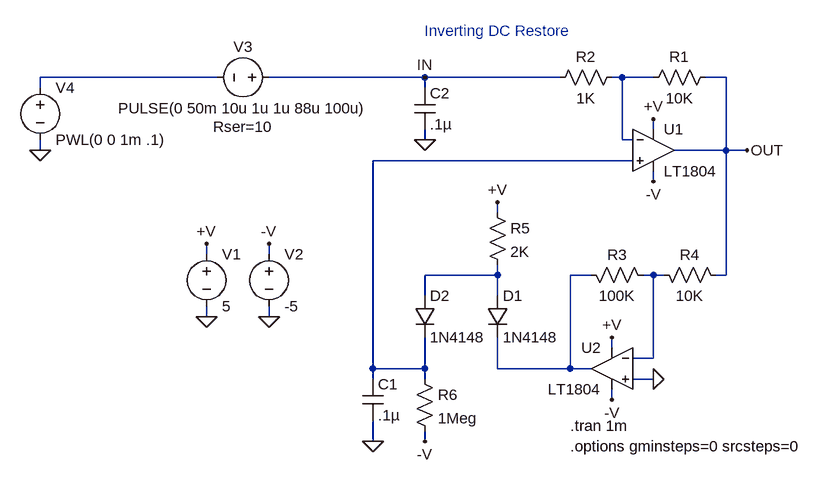
[diagram p0: schematic 1804.asc]
1804.asc, the LTspice schematic file:
Version 4
SHEET 1 896 740
WIRE -464 80 -736 80
WIRE -144 80 -384 80
WIRE 64 80 -144 80
WIRE 160 80 144 80
WIRE 208 80 160 80
WIRE 320 80 288 80
WIRE -736 96 -736 80
WIRE -144 96 -144 80
WIRE 208 160 208 144
WIRE -144 176 -144 160
WIRE 160 176 160 80
WIRE 176 176 160 176
WIRE -736 192 -736 176
WIRE 320 192 320 80
WIRE 320 192 240 192
WIRE 352 192 320 192
WIRE 176 208 -224 208
WIRE 208 240 208 224
WIRE -32 288 -32 272
WIRE -480 352 -480 336
WIRE -384 352 -384 336
WIRE -32 384 -32 368
WIRE -32 384 -144 384
WIRE 112 384 80 384
WIRE 208 384 192 384
WIRE 224 384 208 384
WIRE 320 384 320 192
WIRE 320 384 304 384
WIRE -144 416 -144 384
WIRE -32 416 -32 384
WIRE -480 448 -480 432
WIRE -384 448 -384 432
WIRE 144 496 144 480
WIRE 208 512 208 384
WIRE 208 512 176 512
WIRE -224 528 -224 208
WIRE -144 528 -144 480
WIRE -144 528 -224 528
WIRE -32 528 -32 480
WIRE 80 528 80 384
WIRE 80 528 -32 528
WIRE 112 528 80 528
WIRE -224 544 -224 528
WIRE -144 544 -144 528
WIRE 208 544 176 544
WIRE 144 576 144 560
WIRE -224 640 -224 608
WIRE -144 640 -144 624
FLAG -480 448 0
FLAG 208 144 +V
FLAG -480 336 +V
FLAG 208 240 -V
FLAG -384 448 0
FLAG -384 336 -V
FLAG 144 480 +V
FLAG 144 576 -V
FLAG 208 544 0
FLAG -32 272 +V
FLAG -224 640 0
FLAG -736 192 0
FLAG 352 192 OUT
FLAG -144 640 -V
FLAG -144 176 0
FLAG -144 80 IN
SYMBOL voltage -480 336 R0
SYMATTR InstName V1
SYMATTR Value 5
SYMBOL voltage -384 336 R0
SYMATTR InstName V2
SYMATTR Value -5
SYMBOL res 304 64 R90
WINDOW 0 0 56 VBottom 2
WINDOW 3 32 56 VTop 2
SYMATTR InstName R1
SYMATTR Value 10K
SYMBOL res 160 64 R90
WINDOW 0 0 56 VBottom 2
WINDOW 3 32 56 VTop 2
SYMATTR InstName R2
SYMATTR Value 1K
SYMBOL res 96 368 M90
WINDOW 0 0 56 VBottom 2
WINDOW 3 32 56 VTop 2
SYMATTR InstName R3
SYMATTR Value 100K
SYMBOL res 208 368 M90
WINDOW 0 0 56 VBottom 2
WINDOW 3 32 56 VTop 2
SYMATTR InstName R4
SYMATTR Value 10K
SYMBOL diode -48 416 R0
SYMATTR InstName D1
SYMATTR Value 1N4148
SYMBOL diode -160 416 R0
SYMATTR InstName D2
SYMATTR Value 1N4148
SYMBOL res -48 272 R0
SYMATTR InstName R5
SYMATTR Value 2K
SYMBOL res -160 528 R0
SYMATTR InstName R6
SYMATTR Value 1Meg
SYMBOL cap -240 544 R0
SYMATTR InstName C1
SYMATTR Value .1µ
SYMBOL voltage -368 80 R90
WINDOW 39 60 56 VTop 2
WINDOW 0 -32 56 VBottom 2
WINDOW 3 32 56 VTop 2
SYMATTR SpiceLine Rser=10
SYMATTR InstName V3
SYMATTR Value PULSE(0 50m 10u 1u 1u 88u 100u)
SYMBOL voltage -736 80 R0
WINDOW 123 0 0 Left 2
WINDOW 39 0 0 Left 2
SYMATTR InstName V4
SYMATTR Value PWL(0 0 1m .1)
SYMBOL cap -160 96 R0
SYMATTR InstName C2
SYMATTR Value .1µ
SYMBOL opamps\\LT1804 208 192 R0
SYMATTR InstName U1
SYMBOL opamps\\LT1804 144 528 M0
SYMATTR InstName U2
TEXT 80 616 Left 2 !.tran 1m\n.options gminsteps=0 srcsteps=0
TEXT -32 24 Bottom 2 ;Inverting DC Restore

The netlist it stands for:
* 1804.asc
V1 +V 0 5
V2 -V 0 -5
R1 OUT N002 10K
R2 N002 IN 1K
R3 N005 N006 100K
R4 N006 OUT 10K
D1 N004 N005 1N4148
D2 N004 N003 1N4148
R5 +V N004 2K
R6 N003 -V 1Meg
C1 N003 0 .1µ
V3 IN N001 PULSE(0 50m 10u 1u 1u 88u 100u) Rser=10
V4 N001 0 PWL(0 0 1m .1)
C2 IN 0 .1µ
* U1: LT1804 (symbol opamps\LT1804 not available, pins judged from their places): In+=N003 In-=N002 V+=+V V-=-V OUT=OUT
* U2: LT1804 (symbol opamps\LT1804 not available, pins judged from their places): In+=0 In-=N006 V+=+V V-=-V OUT=N005
.model D D
.lib standard.dio
.tran 1m
.options gminsteps=0 srcsteps=0
* Inverting DC Restore
.backanno
.end